# EAGLE design DisplayModulev3 (EAGLE 6.1)
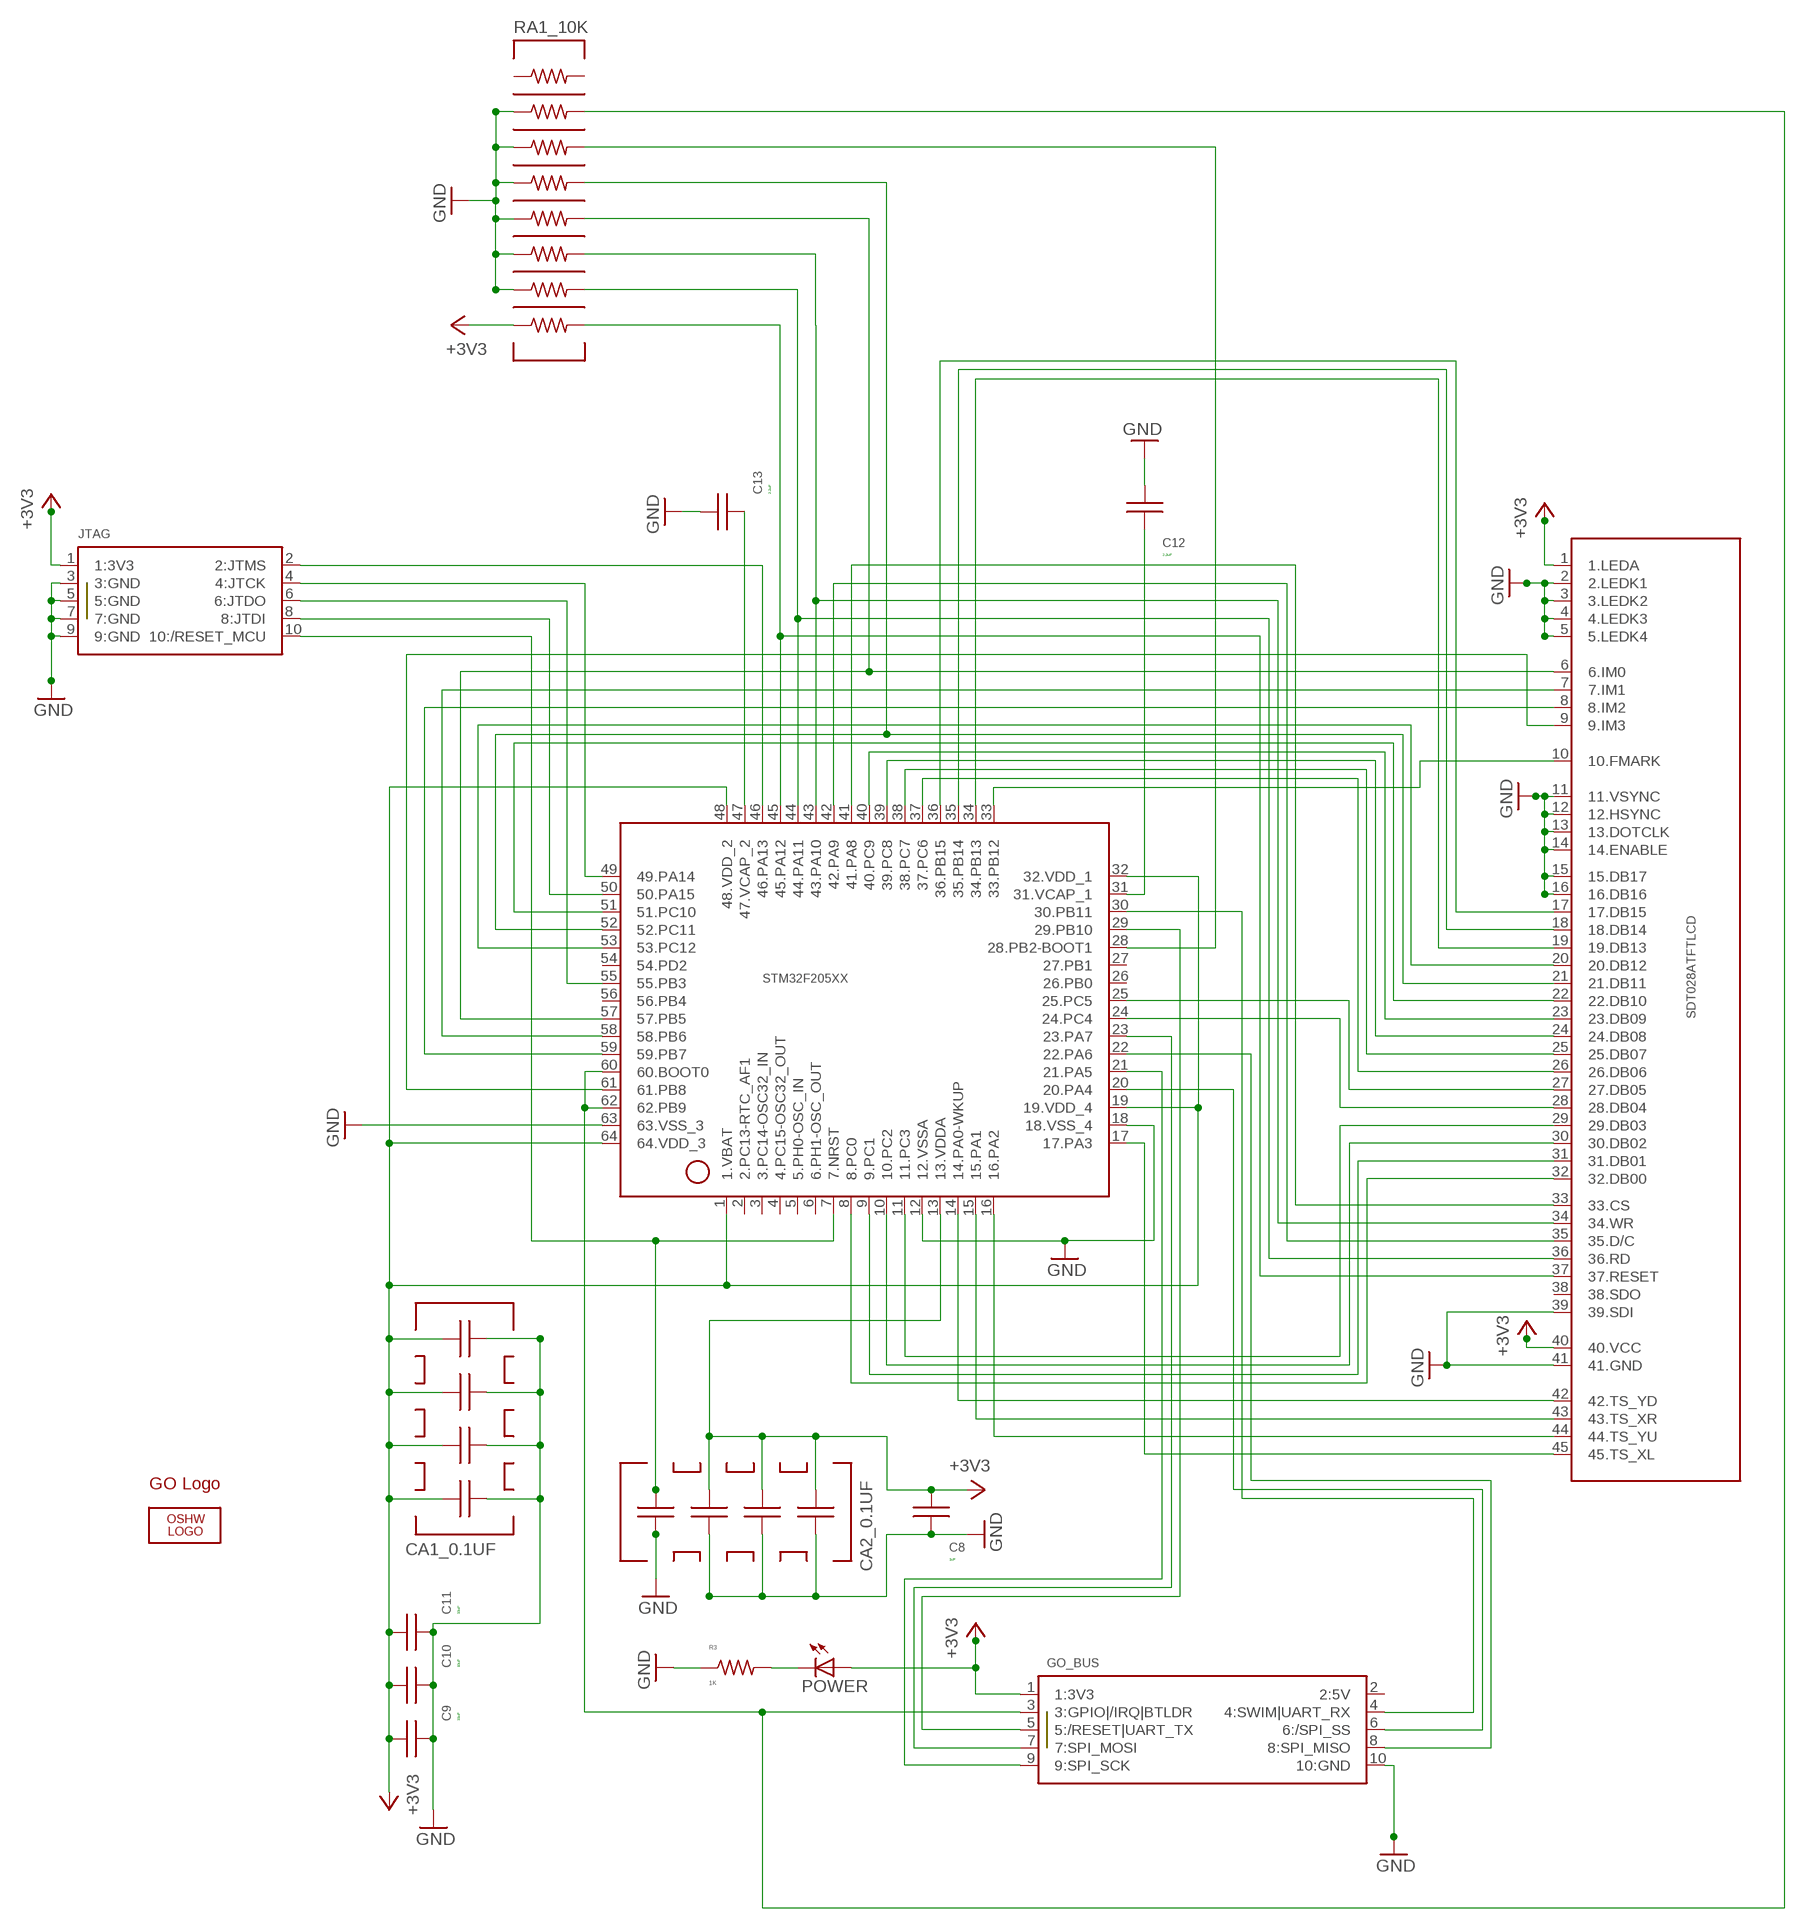
[diagram p0: schematic, sheet 1]

## Parts
C8  1UF  MURATA_GRM_1UF_CER_CAP_0805  [0805]
C9  10UF  MURATA_GRM_10UF_CER_0805  [0805]
C10  10UF  MURATA_GRM_10UF_CER_0805  [0805]
C11  10UF  MURATA_GRM_10UF_CER_0805  [0805]
C12  2.2UF  CAP_CER_2.2UF_0805  [0805]
C13  2.2UF  CAP_CER_2.2UF_0805  [0805]
CA1_0.1UF  TAYIO-YUDEN_0.1UF_CAP_ARRAY_0805  [TAYIO-YUDEN_CAP_ARRAY_4_CIRCUITS_0805]
CA2_0.1UF  TAYIO-YUDEN_0.1UF_CAP_ARRAY_0805  [TAYIO-YUDEN_CAP_ARRAY_4_CIRCUITS_0805]
GO_BUS  GO_CONNECTOR  [FCI-1.27X1.27MM_10PIN_HEADER_SHROUDED_SMT]
JTAG  FCI-MINI_JTAG_HEADER  [FCI-MINI_JTAG_CONNECTOR]
LOGO1  OSHW_LOGO_FILLX0150-NT  [OSHW_FILLX150_NOTEXT]
POWER  LITEON_WHITE_LED_0805  [0805]
R3  1K  RESISTOR_0805  [0805]
RA1_10K  10K  CTS_742C163_RES_ARRAY_8_CIRCUITS_0603  [CTS_742C163_RES_ARRAY_8_CIRCUITS_0603]
SDT028ATFTLCD  HIROSE-FH12  [HIROSE-FH12S-45S-0.5SH]
STM32F205XX  STM32F205XXCORTEXM3RET  [STM32F205XX_LQFP64]
U$1  GO_LOGO  [GO_LOGO]

## Nets
+3V3: C8.K C9.K C10.K C11.K CA1_0.1UF.2 CA1_0.1UF.4 CA1_0.1UF.6 CA1_0.1UF.8 CA2_0.1UF.1 CA2_0.1UF.3 CA2_0.1UF.7 GO_BUS.1(1:3V3) JTAG.1(1:3V3) POWER.A RA1_10K.16 SDT028ATFTLCD.1(1.LEDA) SDT028ATFTLCD.40(40.VCC) STM32F205XX.1(1.VBAT) STM32F205XX.13(13.VDDA) STM32F205XX.19(19.VDD_4) STM32F205XX.32(32.VDD_1) STM32F205XX.48(48.VDD_2) STM32F205XX.64(64.VDD_3)
GND: C8.A C9.A C10.A C11.A C12.K C13.K CA1_0.1UF.1 CA1_0.1UF.3 CA1_0.1UF.5 CA1_0.1UF.7 CA2_0.1UF.2 CA2_0.1UF.4 CA2_0.1UF.6 CA2_0.1UF.8 GO_BUS.10(10:GND) JTAG.3(3:GND) JTAG.5(5:GND) JTAG.7(7:GND) JTAG.9(9:GND) R3.A RA1_10K.4 RA1_10K.6 RA1_10K.8 RA1_10K.10 RA1_10K.12 RA1_10K.14 SDT028ATFTLCD.2(2.LEDK1) SDT028ATFTLCD.3(3.LEDK2) SDT028ATFTLCD.4(4.LEDK3) SDT028ATFTLCD.5(5.LEDK4) SDT028ATFTLCD.11(11.VSYNC) SDT028ATFTLCD.12(12.HSYNC) SDT028ATFTLCD.13(13.DOTCLK) SDT028ATFTLCD.14(14.ENABLE) SDT028ATFTLCD.15(15.DB17) SDT028ATFTLCD.16(16.DB16) SDT028ATFTLCD.39(39.SDI) SDT028ATFTLCD.41(41.GND) STM32F205XX.12(12.VSSA) STM32F205XX.18(18.VSS_4) STM32F205XX.63(63.VSS_3)
N$1: JTAG.2(2:JTMS) STM32F205XX.46(46.PA13)
N$2: JTAG.4(4:JTCK) STM32F205XX.49(49.PA14)
N$3: JTAG.6(6:JTDO) STM32F205XX.55(55.PB3)
N$4: JTAG.8(8:JTDI) STM32F205XX.50(50.PA15)
N$5: CA2_0.1UF.5 JTAG.10(10:/RESET_MCU) STM32F205XX.7(7.NRST)
N$6: SDT028ATFTLCD.32(32.DB00) STM32F205XX.8(8.PC0)
N$7: SDT028ATFTLCD.31(31.DB01) STM32F205XX.9(9.PC1)
N$8: SDT028ATFTLCD.30(30.DB02) STM32F205XX.10(10.PC2)
N$9: SDT028ATFTLCD.29(29.DB03) STM32F205XX.11(11.PC3)
N$10: SDT028ATFTLCD.28(28.DB04) STM32F205XX.24(24.PC4)
N$11: SDT028ATFTLCD.27(27.DB05) STM32F205XX.25(25.PC5)
N$12: SDT028ATFTLCD.26(26.DB06) STM32F205XX.37(37.PC6)
N$13: SDT028ATFTLCD.25(25.DB07) STM32F205XX.38(38.PC7)
N$14: SDT028ATFTLCD.24(24.DB08) STM32F205XX.39(39.PC8)
N$15: SDT028ATFTLCD.23(23.DB09) STM32F205XX.40(40.PC9)
N$16: SDT028ATFTLCD.22(22.DB10) STM32F205XX.51(51.PC10)
N$17: RA1_10K.7 SDT028ATFTLCD.21(21.DB11) STM32F205XX.52(52.PC11)
N$18: SDT028ATFTLCD.20(20.DB12) STM32F205XX.53(53.PC12)
N$19: SDT028ATFTLCD.19(19.DB13) STM32F205XX.34(34.PB13)
N$20: SDT028ATFTLCD.18(18.DB14) STM32F205XX.35(35.PB14)
N$21: SDT028ATFTLCD.17(17.DB15) STM32F205XX.36(36.PB15)
N$22: SDT028ATFTLCD.42(42.TS_YD) STM32F205XX.14(14.PA0-WKUP)
N$23: SDT028ATFTLCD.43(43.TS_XR) STM32F205XX.15(15.PA1)
N$24: SDT028ATFTLCD.44(44.TS_YU) STM32F205XX.16(16.PA2)
N$25: SDT028ATFTLCD.45(45.TS_XL) STM32F205XX.17(17.PA3)
N$26: SDT028ATFTLCD.8(8.IM2) STM32F205XX.59(59.PB7)
N$27: RA1_10K.9 SDT028ATFTLCD.6(6.IM0) STM32F205XX.57(57.PB5)
N$28: SDT028ATFTLCD.7(7.IM1) STM32F205XX.58(58.PB6)
N$29: SDT028ATFTLCD.9(9.IM3) STM32F205XX.61(61.PB8)
N$30: SDT028ATFTLCD.33(33.CS) STM32F205XX.41(41.PA8)
N$31: SDT028ATFTLCD.35(35.D/C) STM32F205XX.42(42.PA9)
N$32: RA1_10K.11 SDT028ATFTLCD.34(34.WR) STM32F205XX.43(43.PA10)
N$33: RA1_10K.13 SDT028ATFTLCD.36(36.RD) STM32F205XX.44(44.PA11)
N$34: RA1_10K.15 SDT028ATFTLCD.37(37.RESET) STM32F205XX.45(45.PA12)
N$35: SDT028ATFTLCD.10(10.FMARK) STM32F205XX.33(33.PB12)
N$36: GO_BUS.6(6:/SPI_SS) STM32F205XX.20(20.PA4)
N$37: GO_BUS.9(9:SPI_SCK) STM32F205XX.21(21.PA5)
N$38: GO_BUS.8(8:SPI_MISO) STM32F205XX.22(22.PA6)
N$39: GO_BUS.7(7:SPI_MOSI) STM32F205XX.23(23.PA7)
N$40: GO_BUS.5(5:/RESET|UART_TX) STM32F205XX.29(29.PB10)
N$41: GO_BUS.4(4:SWIM|UART_RX) STM32F205XX.30(30.PB11)
N$42: GO_BUS.3(3:GPIO|/IRQ|BTLDR) RA1_10K.3 STM32F205XX.60(60.BOOT0) STM32F205XX.62(62.PB9)
N$43: C12.A STM32F205XX.31(31.VCAP_1)
N$44: C13.A STM32F205XX.47(47.VCAP_2)
N$45: RA1_10K.5 STM32F205XX.28(28.PB2-BOOT1)
N$46: POWER.K(C) R3.K
Unconnected: RA1_10K.1 RA1_10K.2 SDT028ATFTLCD.38(38.SDO) STM32F205XX.2(2.PC13-RTC_AF1) STM32F205XX.3(3.PC14-OSC32_IN) STM32F205XX.4(4.PC15-OSC32_OUT) STM32F205XX.5(5.PH0-OSC_IN) STM32F205XX.6(6.PH1-OSC_OUT) STM32F205XX.26(26.PB0) STM32F205XX.27(27.PB1) STM32F205XX.54(54.PD2) STM32F205XX.56(56.PB4)

## Notes on the sheet
- 2.2uF
- 2.2uF
- 1uF
- 10uF
- 10uF
- 10uF

## Power pins joined to a net without a drawn wire
2:5V: GO_BUS.2(2:5V)

## Library data of the parts
C8 = Nwazet.Go:MURATA_GRM_1UF_CER_CAP_0805
C9-C11 = Nwazet.Go:MURATA_GRM_10UF_CER_0805
C12 C13 = Nwazet.Go:CAP_CER_2.2UF_0805
CA1_0.1UF CA2_0.1UF = Nwazet.Go:TAYIO-YUDEN_0.1UF_CAP_ARRAY_0805
GO_BUS = Nwazet.Go:GO_CONNECTOR
JTAG = Nwazet.Go:FCI-MINI_JTAG_HEADER
LOGO1 = ohw-logo:OSHW_LOGO_FILL
POWER = Nwazet.Go:LITEON_WHITE_LED_0805
R3 = Nwazet.Go:RESISTOR_0805
RA1_10K = Nwazet.Go:CTS_742C163_RES_ARRAY_8_CIRCUITS_0603
SDT028ATFTLCD = Nwazet.Go:HIROSE-FH12
STM32F205XX = Nwazet.Go:STM32F205XX
U$1 = Nwazet.Go:GO_LOGO

## Board
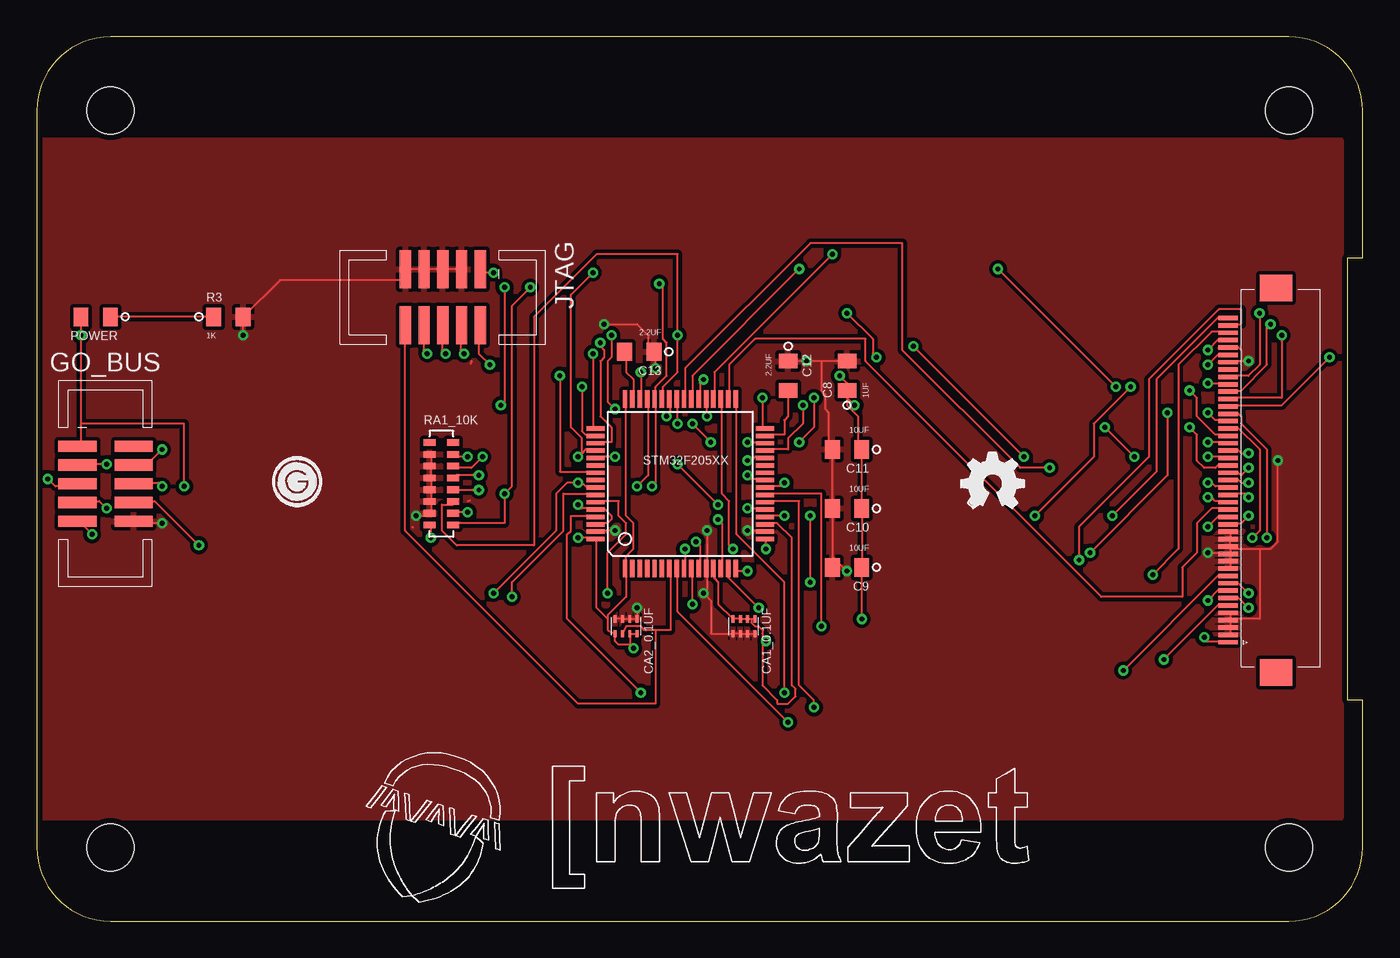
[diagram p1: board, top side]
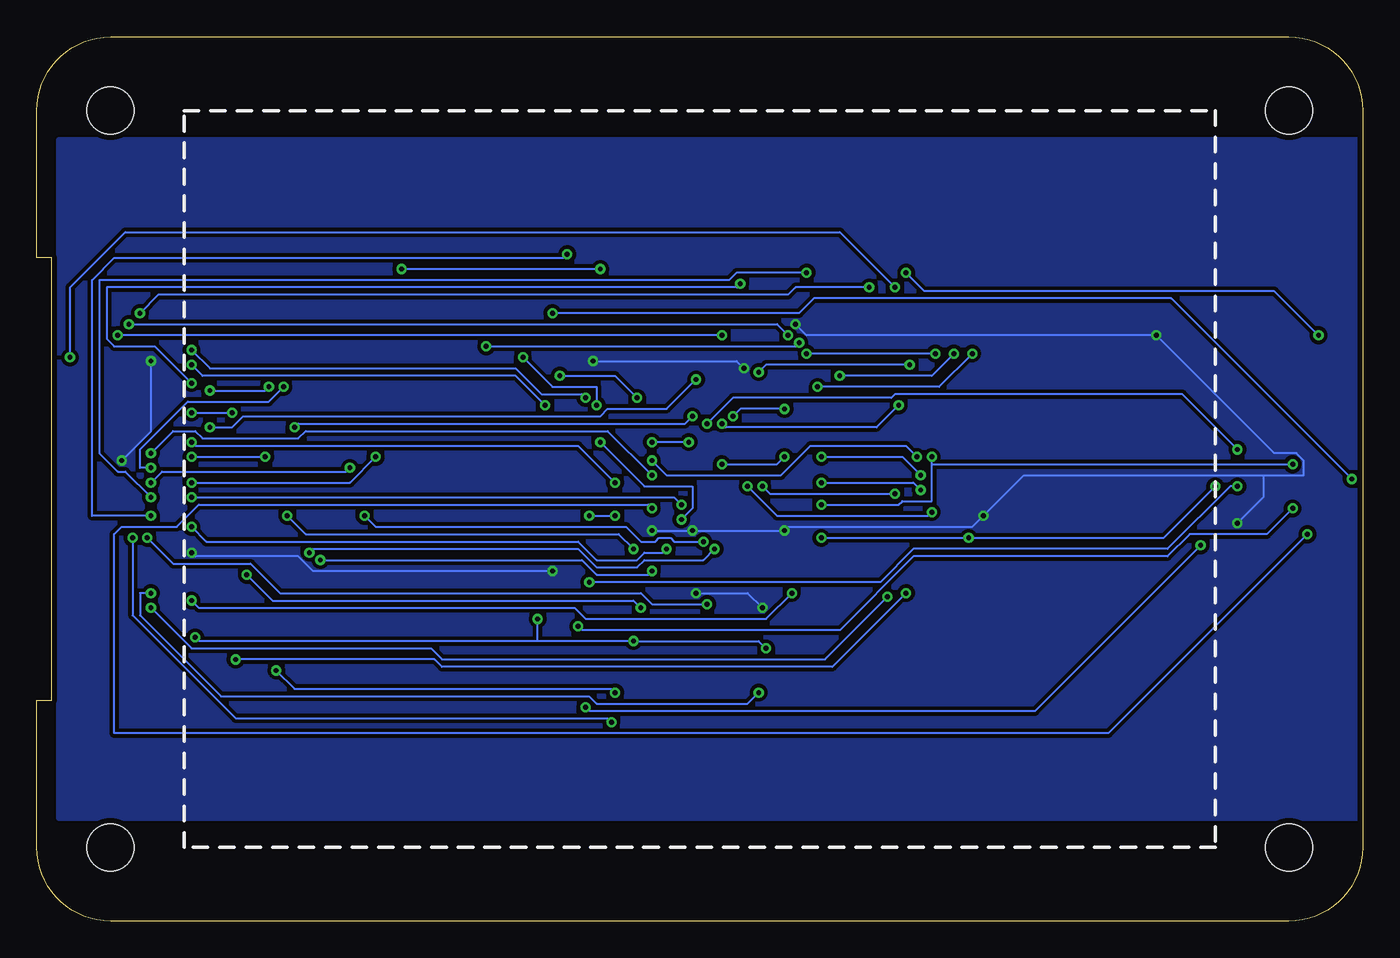
[diagram p2: board, bottom side, seen from below]

Size 90 x 60 mm. Coordinates in mm from the lower left corner, seen from the top.
Outline: 5,0 85,0 arc90 90,5 90,15 89,15 89,45 90,45 90,55 arc90 85,60 5,60 arc90 0,55 0,5 arc90 5,0
Copper layers (1*16): Top 0.0356mm / dielectric 1.5011mm / Bottom 0.0356mm
Design rules: minimum track width 6mil, minimum drill 13mil, track to track 6mil, track to pad 6mil, pad to pad 6mil, via to via 6mil, smd to smd 6mil, copper to edge 15mil, drill to drill 6mil, minimum pad ring 7mil, minimum via ring 7mil, stop-mask expansion 4mil, vias tented up to drill 0mil, thermal gap 10mil
Holes 3.2 mm at 5,5 5,55 85,55 85,5

### Footprints (pad centres in the part's own frame; a part is rotated, then mirrored left to right if it is on the bottom)
0805 = smd 1.25 x 1: A 0,1; K 0,-1
TAYIO-YUDEN_CAP_ARRAY_4_CIRCUITS_0805 = smd 0.2 x 0.5: 1 -0.75,0.5; 2 -0.75,-0.5; 3 -0.25,0.5; 4 -0.25,-0.5; 5 0.25,0.5; 6 0.25,-0.5; 7 0.75,0.5; 8 0.75,-0.5
FCI-1.27X1.27MM_10PIN_HEADER_SHROUDED_SMT = smd 0.76 x 2.6: 1 -2.54,-1.905; 2 -2.54,1.905; 3 -1.27,-1.905; 4 -1.27,1.905; 5 0,-1.905; 6 0,1.905; 7 1.27,-1.905; 8 1.27,1.905; 9 2.54,-1.905; 10 2.54,1.905
FCI-MINI_JTAG_CONNECTOR = smd 0.76 x 2.6: 1 -2.54,-1.905; 2 -2.54,1.905; 3 -1.27,-1.905; 4 -1.27,1.905; 5 0,-1.905; 6 0,1.905; 7 1.27,-1.905; 8 1.27,1.905; 9 2.54,-1.905; 10 2.54,1.905
CTS_742C163_RES_ARRAY_8_CIRCUITS_0603 = smd 0.45 x 0.8: 1 -2.8,0.8; 2 -2.8,-0.8; 3 -2,0.8; 4 -2,-0.8; 5 -1.2,0.8; 6 -1.2,-0.8; 7 -0.4,0.8; 8 -0.4,-0.8; 9 0.4,0.8; 10 0.4,-0.8; 11 1.2,0.8; 12 1.2,-0.8; 13 2,0.8; 14 2,-0.8; 15 2.8,0.8; 16 2.8,-0.8
HIROSE-FH12S-45S-0.5SH = smd 0.3 x 1.3: 1 10.75,-0.65; 2 10.25,-0.65; 3 9.75,-0.65; 4 9.25,-0.65; 5 8.75,-0.65; 6 8.25,-0.65; 7 7.75,-0.65; 8 7.25,-0.65; 9 6.75,-0.65; 10 6.25,-0.65; 11 5.75,-0.65; 12 5.25,-0.65; 13 4.75,-0.65; 14 4.25,-0.65; 15 3.75,-0.65; 16 3.25,-0.65; 17 2.75,-0.65; 18 2.25,-0.65; 19 1.75,-0.65; 20 1.25,-0.65; 21 0.75,-0.65; 22 0.25,-0.65; 23 -0.25,-0.65; 24 -0.75,-0.65; 25 -1.25,-0.65; 26 -1.75,-0.65; 27 -2.25,-0.65; 28 -2.75,-0.65; 29 -3.25,-0.65; 30 -3.75,-0.65; 31 -4.25,-0.65; 32 -4.75,-0.65; 33 -5.25,-0.65; 34 -5.75,-0.65; 35 -6.25,-0.65; 36 -6.75,-0.65; 37 -7.25,-0.65; 38 -7.75,-0.65; 39 -8.25,-0.65; 40 -8.75,-0.65; 41 -9.25,-0.65; 42 -9.75,-0.65; 43 -10.25,-0.65; 44 -10.75,-0.65; 45 -11.25,-0.65 | smd 1.8 x 2.2: P$46 -13.3,2.6; P$47 12.8,2.6
STM32F205XX_LQFP64 = smd 0.3 x 1.2: 1 -3.75,-5.75; 2 -3.25,-5.75; 3 -2.75,-5.75; 4 -2.25,-5.75; 5 -1.75,-5.75; 6 -1.25,-5.75; 7 -0.75,-5.75; 8 -0.25,-5.75; 9 0.25,-5.75; 10 0.75,-5.75; 11 1.25,-5.75; 12 1.75,-5.75; 13 2.25,-5.75; 14 2.75,-5.75; 15 3.25,-5.75; 16 3.75,-5.75; 33 3.75,5.75; 34 3.25,5.75; 35 2.75,5.75; 36 2.25,5.75; 37 1.75,5.75; 38 1.25,5.75; 39 0.75,5.75; 40 0.25,5.75; 41 -0.25,5.75; 42 -0.75,5.75; 43 -1.25,5.75; 44 -1.75,5.75; 45 -2.25,5.75; 46 -2.75,5.75; 47 -3.25,5.75; 48 -3.75,5.75 | smd 1.2 x 0.3: 17 5.75,-3.75; 18 5.75,-3.25; 19 5.75,-2.75; 20 5.75,-2.25; 21 5.75,-1.75; 22 5.75,-1.25; 23 5.75,-0.75; 24 5.75,-0.25; 25 5.75,0.25; 26 5.75,0.75; 27 5.75,1.25; 28 5.75,1.75; 29 5.75,2.25; 30 5.75,2.75; 31 5.75,3.25; 32 5.75,3.75; 49 -5.75,3.75; 50 -5.75,3.25; 51 -5.75,2.75; 52 -5.75,2.25; 53 -5.75,1.75; 54 -5.75,1.25; 55 -5.75,0.75; 56 -5.75,0.25; 57 -5.75,-0.25; 58 -5.75,-0.75; 59 -5.75,-1.25; 60 -5.75,-1.75; 61 -5.75,-2.25; 62 -5.75,-2.75; 63 -5.75,-3.25; 64 -5.75,-3.75

### Placement (x,y rotation side)
C8  55,37 0 top
C9  55,24 90 top
C10  55,28 90 top
C11  55,32 90 top
C12  51,37 180 top
C13  40.9,38.63 90 top
CA1_0.1UF  48,20 180 top
CA2_0.1UF  40,20 180 top
GO_BUS  4.67,29.67 270 top
JTAG  27.56,42.33 180 top
LOGO1  62.75,28 0 top
POWER  4,41 90 top
R3  13,41 270 top
RA1_10K  27.46,29.67 270 top
SDT028ATFTLCD  81.51,29.67 270 top
STM32F205XX  43.68,29.67 0 top
U$1  17.75,29.67 0 top

### Tracks (layer width: path | path; a pad name or v marks a point on that pad's centre or on a via)
+3V3  (via drill 0.33)
  Top 0.152: v49.25,35.5 49.25,33.5 STM32F205XX.32 | v54.5,37 55,36.5 C8.K 55,35.5 | v79.5,37.75 80.25,38.5 80.75,38.5 SDT028ATFTLCD.40 | 55,35.5 v55.5,35 | 55,35.5 55,35 55.75,34.25 55.75,32.25 C11.K C10.K C9.K v56,20.5 | 3,33.75 3,32.25 GO_BUS.1 | 3,33.75 v3,39.75 POWER.A | v31,44 30.25,44 JTAG.1 | v26.75,26 26.75,26.75 RA1_10K.16 | v36.75,26 37.75,26 STM32F205XX.64 38,26 38,21.25 38.75,20.5 | 40.25,18.75 39.5,18.75 39.25,19 CA2_0.1UF.7 38.75,19.75 38.75,20.5 | 40.25,18.75 CA2_0.1UF.3 CA2_0.1UF.1 | 38.75,20.5 38.75,20.75 40,22 40,23.75 STM32F205XX.1 40,24 40,24.75 40.5,25.25 40.5,27 40,27.5 40,35.25 STM32F205XX.48 | 48.5,20.5 CA1_0.1UF.4 CA1_0.1UF.6 CA1_0.1UF.8 46.25,21.5 46.25,23 46,23.25 46,23.75 STM32F205XX.13 | 48.5,20.5 CA1_0.1UF.2 | 49.25,19 49.25,19.5 49.25,19.75 49,20 48.75,20 48.5,20.25 48.5,20.5 | 49.25,19 49.25,16 50.25,15 50.25,14.75 51,14.75 51.5,15.25 51.5,15.75 51.25,16 51.25,26 50.25,27 49.5,27 STM32F205XX.19 | v79.25,19.25 79.25,19 80.75,19 SDT028ATFTLCD.1 | 49.25,19 v49.5,19 | v40.5,18.5 40.25,18.75 | 3,33.75 10,33.75 v10,29.5
  Bottom 0.152: v49.25,35.5 50.75,37 v54.5,37 | v79.5,37.75 78.75,37 57.5,37 v55.5,35 | v31,44 29.75,42.75 6,42.75 v3,39.75 | v36.75,26 v26.75,26 13.5,26 v10,29.5 | v79.25,19.25 79,19 56,19 | 56,19 v49.5,19 41,19 v40.5,18.5 | 56,19 v56,20.5
GND  (via drill 0.33)
  Top 0.152: 81,20 81,19.5 SDT028ATFTLCD.2 | 81,20 SDT028ATFTLCD.3 81,20 | 81,20.5 81,21 SDT028ATFTLCD.5 | 81,20.5 SDT028ATFTLCD.4 | 81,20.5 81,20 | 81,20.5 SDT028ATFTLCD.4 | 81.75,38 81,38 SDT028ATFTLCD.39 | 81.75,38 81.75,38.75 81.5,39 81,39 SDT028ATFTLCD.41 | 81,26 81,26.5 SDT028ATFTLCD.16 | 81,26 SDT028ATFTLCD.15 81,26 | 81,24.5 81,24 SDT028ATFTLCD.11 | 81,24.5 SDT028ATFTLCD.12 81,24.5 | 81,25.5 81,25.25 | 81,25.25 81,25 | 81,25 SDT028ATFTLCD.13 | 81,25.5 SDT028ATFTLCD.14 81,25.5 | 81,25 81,24.5 | 81,25 SDT028ATFTLCD.13 | 81,25.5 81,26 | v82.25,38 81.75,38 | v84.25,31.25 84.25,25.75 83.75,25.25 83,25.25 | 81,25.25 83,25.25 | 81,20.5 83,20.5 83,25.25 | 81,20.5 SDT028ATFTLCD.4 | 54,24.75 C10.A C11.A 53.75,32.25 53.75,34.5 53.5,34.75 53.5,35.75 53.25,36 53.25,38 | 54,24.75 C9.A | C8.A 53.25,38 | 53.25,38 v52.25,38 C12.K | v42,37.5 42,38.5 C13.K 41.75,38.75 41.5,39 41.5,39.75 40.75,40.5 v38.5,40.5 | v79.5,25 80.75,25 SDT028ATFTLCD.13 | 54,24.75 v55,23.75 | JTAG.3 28.75,44.25 27.75,44.25 JTAG.5 27.5,44.25 26.5,44.25 JTAG.7 26.25,44.25 25.25,44.25 JTAG.9 25,44 25,43.5 16.5,43.5 R3.A v14,39.75 | CA1_0.1UF.1 CA1_0.1UF.3 CA1_0.1UF.5 CA1_0.1UF.7 45.75,19.5 45.75,21.75 v45.25,22.25 45.5,22.5 45.5,23.75 STM32F205XX.12 45.5,24 v45.5,26.5 | CA2_0.1UF.8 CA2_0.1UF.6 CA2_0.1UF.4 CA2_0.1UF.2 v40.75,21.25 | RA1_10K.4 26.75,31.5 26.75,31 RA1_10K.6 26.75,30.75 26.75,30.25 RA1_10K.8 26.75,30 26.75,29.25 | 26.75,29.25 RA1_10K.10 26.75,29.25 | 26.75,29.25 26.75,28.5 RA1_10K.12 26.75,28.25 26.75,27.75 RA1_10K.14 26.5,27.5 v25.75,27.5 | v39.25,26.5 38,26.5 STM32F205XX.63 | v48.25,26.5 49.25,26.5 STM32F205XX.18 | v8.5,27 6.75,27 GO_BUS.10
  Top 0.152: 29.25,28.5 29.41,28.55 | 29.25,28.5 29.41,28.55 | 29.25,28.5 29.41,28.55 | 29.25,28.5 29.41,28.55 | 29.25,28.5 29.41,28.55 | 29.25,28.5 29.41,28.55 | 26.25,27.75 26.25,27.67 | 26.25,27.75 26.25,27.67 | 26.25,27.75 26.25,27.67 | 26.25,27.75 26.25,27.67 | 26.25,27.75 26.25,27.67 | 26.25,27.75 26.25,27.67 | 29.5,38 29.45,37.82 | 29.5,38 29.45,37.82 | 29.5,38 29.45,37.82 | 29.5,38 29.45,37.82 | 29.5,38 29.45,37.82 | 29.5,38 29.45,37.82 | 29.5,38 29.45,37.82 | 29.5,38 29.45,37.82 | 25.5,26.75 25.53,26.72 | 25.5,26.75 25.53,26.72 | 25.5,26.75 25.53,26.72 | 25.5,26.75 25.53,26.72 | 25.5,26.75 25.53,26.72 | 25.5,26.75 25.53,26.72 | 29.25,28.5 29.41,28.55 | 29.25,28.5 29.41,28.55 | 29.25,28.5 29.41,28.55 | 29.25,28.5 29.41,28.55 | 29.25,28.5 29.41,28.55 | 29.25,28.5 29.41,28.55 | 26.25,27.75 26.25,27.67 | 26.25,27.75 26.25,27.67 | 26.25,27.75 26.25,27.67 | 26.25,27.75 26.25,27.67 | 26.25,27.75 26.25,27.67 | 26.25,27.75 26.25,27.67 | 29.5,38 29.45,37.82 | 29.5,38 29.45,37.82 | 29.5,38 29.45,37.82 | 29.5,38 29.45,37.82 | 29.5,38 29.45,37.82 | 29.5,38 29.45,37.82 | 29.5,38 29.45,37.82 | 29.5,38 29.45,37.82 | 25.5,26.75 25.53,26.72 | 25.5,26.75 25.53,26.72 | 25.5,26.75 25.53,26.72 | 25.5,26.75 25.53,26.72 | 25.5,26.75 25.53,26.72
  Bottom 0.152: v82.25,38 82.25,33.25 v84.25,31.25 | v42,37.5 42.5,38 v52.25,38 | v79.5,25 79.25,24.75 72.25,24.75 71.25,23.75 v55,23.75 | v40.75,21.25 41.75,22.25 v45.25,22.25 | v48.25,26.5 v45.5,26.5 v39.25,26.5 39,26.75 26.5,26.75 v25.75,27.5 23,30.25 6.75,30.25 | v8.5,27 6.75,28.75 6.75,30.25 | 6.75,30.25 4,30.25 4,31.25 4.5,31.75 6,31.75 v14,39.75 37.75,39.75 v38.5,40.5
  pour Bottom (isolate 0.254): 0.25,53 88.5,53 88.5,7 0.25,7
  pour Top (isolate 0.254): 0.25,53 88.5,53 88.5,7 0.25,7
N$1  (via drill 0.33)
  Top 0.152: v41,37.25 41,35.5 STM32F205XX.46 | v30.75,37.75 30,38.5 30,40.25 JTAG.2
  Bottom 0.152: v41,37.25 40.5,37.75 v30.75,37.75
N$2  (via drill 0.33)
  Top 0.152: v37.75,38.5 37.75,33.5 STM32F205XX.49 | v29,38.5 28.75,38.75 28.75,40.25 JTAG.4
  Bottom 0.152: v29,38.5 v37.75,38.5
N$3  (via drill 0.33)
  Top 0.152: v35.5,37 35.5,30.5 37.75,30.5 STM32F205XX.55 | v27.75,38.5 27.5,38.75 27.5,40.25 JTAG.6
  Bottom 0.152: v35.5,37 29.25,37 v27.75,38.5
N$4  (via drill 0.33)
  Top 0.152: v37,36.25 37,33.25 37.25,33 37.75,33 STM32F205XX.50 | v26.5,38.5 26.25,38.75 26.25,40.25 JTAG.8
  Bottom 0.152: v37,36.25 28.75,36.25 v26.5,38.5
N$5
  Top 0.152: CA2_0.1UF.5 40,20 40.75,20 41,20 41.25,19.75 42,19.75 | 42,19.75 43,19.75 43,23.75 STM32F205XX.7 | 42,19.75 42,14.75 36.75,14.75 25,26.5 25,40.25 JTAG.10
N$6  (via drill 0.33)
  Top 0.152: v51,13.5 43.5,21 43.5,23.75 STM32F205XX.8 | v83.5,26 83.5,32 81.75,33.75 81.75,34.25 81.5,34.5 81,34.5 SDT028ATFTLCD.32
  Bottom 0.152: v51,13.5 51.25,13.75 76.5,13.75 83.5,20.75 v83.5,26
N$7  (via drill 0.33)
  Top 0.152: v44,25.25 44,24 STM32F205XX.9 | v71.5,25 76.75,30.25 v76.75,34.5 | v79.5,34.5 80,34 80.75,34 SDT028ATFTLCD.31
  Bottom 0.152: v44,25.25 44.75,24.5 48.75,24.5 49.25,24 52,24 53.25,25.25 71.25,25.25 v71.5,25 | v79.5,34.5 v76.75,34.5
N$8  (via drill 0.33)
  Top 0.152: v44.5,21.5 44.5,23.75 STM32F205XX.10 | v82.5,26 83,26.5 83,32 81.5,33.5 81,33.5 SDT028ATFTLCD.30
  Bottom 0.152: v44.5,21.5 48.25,21.5 49,22.25 73.5,22.25 75.5,24.25 80.75,24.25 v82.5,26
N$9  (via drill 0.33)
  Top 0.152: v44.75,25.75 45,25.5 45,24 STM32F205XX.11 | v67.75,27.5 71.75,31.5 71.75,33.75 v74.25,36.25 | v78.25,36 78.75,35.5 78.75,34.25 80,33 80.75,33 SDT028ATFTLCD.29
  Bottom 0.152: v44.75,25.75 46.75,25.75 47,26 47.75,26 48,25.75 49,25.75 50,26.75 67,26.75 v67.75,27.5 | v74.25,36.25 74.5,36 v78.25,36
N$10  (via drill 0.33)
  Top 0.152: v50.75,29.75 50.75,29.5 49.5,29.5 STM32F205XX.24 | v79.5,32.5 80.75,32.5 SDT028ATFTLCD.28
  Bottom 0.152: v50.75,29.75 53.25,32.25 79.25,32.25 v79.5,32.5
N$11  (via drill 0.33)
  Top 0.152: v48.25,30.25 48.25,30 49.25,30 STM32F205XX.25 | v82.25,31.75 81.75,31.75 81.5,32 81,32 SDT028ATFTLCD.27
  Bottom 0.152: v48.25,30.25 51.25,33.25 71.75,33.25 72.25,32.75 78.75,32.75 79.25,33.25 80.75,33.25 v82.25,31.75
N$12  (via drill 0.33)
  Top 0.152: v45.5,34.25 45.5,35.25 STM32F205XX.37 | v74.5,31.5 v72.5,33.5 | v79.5,31.5 80.75,31.5 SDT028ATFTLCD.26
  Bottom 0.152: v45.5,34.25 46,33.75 72.25,33.75 v72.5,33.5 | v79.5,31.5 v74.5,31.5
N$13  (via drill 0.33)
  Top 0.152: v45.25,36.75 45,36.5 45,35.5 STM32F205XX.38 | v78.25,33.5 78.75,33 78.75,31.25 79.25,30.75 80,30.75 80.25,31 80.75,31 SDT028ATFTLCD.25
  Bottom 0.152: v45.25,36.75 47.25,34.75 51.25,34.75 51.75,34.25 76,34.25 76.75,33.5 v78.25,33.5
N$14  (via drill 0.33)
  Top 0.152: v51.75,44.25 44.5,37 44.5,35.5 STM32F205XX.39 | v73.25,36.25 v65.25,44.25 | v82.25,30.75 81.75,30.25 81.5,30.5 81,30.5 SDT028ATFTLCD.24
  Bottom 0.152: v65.25,44.25 v51.75,44.25 | v73.25,36.25 74.25,35.25 79.75,35.25 83,32 83,30.75 v82.25,30.75
N$15  (via drill 0.33)
  Top 0.152: v68.75,30.75 66.75,30.75 58.75,38.75 58.75,46 52.5,46 44,37.5 44,35.5 STM32F205XX.40 | v82.25,29.75 81.75,29.75 81.5,30 81,30 SDT028ATFTLCD.23
  Bottom 0.152: v68.75,30.75 69,30.5 81.5,30.5 v82.25,29.75
N$16  (via drill 0.33)
  Top 0.152: v38.25,39.25 38.25,39 38.5,38.75 38.5,38.25 38.25,38 38.25,34.25 39,33.5 39,32.5 38,32.5 STM32F205XX.51 | v67,31.5 v59.5,39 | v79.5,29.75 79.75,29.75 80,29.5 80.75,29.5 SDT028ATFTLCD.22
  Bottom 0.152: v38.25,39.25 38.5,39 v59.5,39 | v67,31.5 68.75,29.75 v79.5,29.75
N$17  (via drill 0.33)
  Top 0.152: v30,30.25 28.5,30.25 RA1_10K.7 | 37,31.75 37.25,32 37.75,32 STM32F205XX.52 | 37,31.75 v36.75,31.5 | v82.25,28.75 82.25,29 81,29 SDT028ATFTLCD.21 | v37.75,44 36.25,42.5 36.25,33.5 37,32.75 37,31.75
  Bottom 0.152: v30,30.25 31.25,31.5 v36.75,31.5 | v82.25,28.75 84,30.5 84.5,30.5 85.75,31.75 85.75,43.5 43,43.5 42.5,44 v37.75,44
N$18  (via drill 0.33)
  Top 0.152: v39.25,31.5 38,31.5 STM32F205XX.53 | v46.25,28.25 v43.5,31 | v79.5,28.75 79.75,28.75 80,28.5 80.75,28.5 SDT028ATFTLCD.20
  Bottom 0.152: v39.25,31.5 39.75,31 v43.5,31 | v46.25,28.25 46.75,28.75 v79.5,28.75
N$19
  Top 0.152: STM32F205XX.34 47,35.5 47,37.75 48.75,39.5 56.25,39.5 56.25,38 72.25,22 77.75,22 77.75,24 78.75,25 78.75,27 79.75,28 80.75,28 SDT028ATFTLCD.19
N$20  (via drill 0.33)
  Top 0.152: v47.25,25.25 47,25.5 47,28.5 46.5,29 46.5,35.25 STM32F205XX.35 | v79.5,26.75 80.25,27.5 80.75,27.5 SDT028ATFTLCD.18
  Bottom 0.152: v47.25,25.25 47.5,25 48.75,25 49.25,24.5 52,24.5 53.25,25.75 78.5,25.75 v79.5,26.75
N$21  (via drill 0.33)
  Top 0.152: v54,45.25 46,37.25 46,35.5 STM32F205XX.36 | v82.25,27.5 81.75,27 81,27 SDT028ATFTLCD.17
  Bottom 0.152: v54,45.25 54.25,45 84.75,45 86.25,43.5 86.25,27.5 v82.25,27.5
N$22  (via drill 0.33)
  Top 0.152: v46.25,27.25 46.5,27 46.5,24 STM32F205XX.14 | v51.75,32.5 52.75,33.5 v52.75,35.5 | v79.5,38.75 80.25,39.5 80.75,39.5 SDT028ATFTLCD.42
  Bottom 0.152: v46.25,27.25 45.5,28 45.5,29.5 48.75,29.5 v51.75,32.5 | v52.75,35.5 53,35.75 55.75,35.75 57.5,37.5 78.25,37.5 v79.5,38.75
N$23  (via drill 0.33)
  Top 0.152: v49,21.25 47,23.25 47,23.75 STM32F205XX.15 | v75.75,23.5 77.5,25.25 77.5,37.75 79.75,40 80.75,40 SDT028ATFTLCD.43
  Bottom 0.152: v49,21.25 49.5,21.75 74,21.75 v75.75,23.5
N$24  (via drill 0.33)
  Top 0.152: v48.25,23.75 47.5,23.75 STM32F205XX.16 | v70.75,24.5 70.75,26.75 75.5,31.5 75.5,36.75 80.25,41.5 81.75,41.5 81.75,40.5 81,40.5 SDT028ATFTLCD.44
  Bottom 0.152: v48.25,23.75 48.5,23.5 52,23.5 53,24.5 v70.75,24.5
N$25  (via drill 0.33)
  Top 0.152: v49.5,25.25 49.5,26 STM32F205XX.17 | v73,27.5 76,30.5 76,36.75 80.25,41 80.75,41 SDT028ATFTLCD.45
  Bottom 0.152: v49.5,25.25 50.5,26.25 71.75,26.25 v73,27.5
N$26  (via drill 0.33)
  Top 0.152: v38.75,22.25 38.75,25 40,26.25 40,27 39.5,27.5 39.5,28.5 38,28.5 STM32F205XX.59 | v79.5,21.75 80.25,22.5 80.75,22.5 SDT028ATFTLCD.8
  Bottom 0.152: v38.75,22.25 40.5,20.5 52.75,20.5 53.5,21.25 79,21.25 v79.5,21.75
N$27  (via drill 0.33)
  Top 0.152: v30,29.25 28.5,29.25 RA1_10K.9 | STM32F205XX.57 37.75,29.5 37.25,29.5 37,29.75 v36.75,29.75 36,29.75 35.25,29 35.25,26.5 v31,22.25 | v76.5,17.75 80.25,21.5 80.75,21.5 SDT028ATFTLCD.6
  Bottom 0.152: v30,29.25 30.5,29.75 v36.75,29.75 | v76.5,17.75 63,17.75 62.5,17.25 36,17.25 v31,22.25
N$28  (via drill 0.33)
  Top 0.152: v32.25,22 32.25,23 35.75,26.5 35.75,29 37.75,29 STM32F205XX.58 | v82.25,21.25 81.5,22 81,22 SDT028ATFTLCD.7
  Bottom 0.152: v32.25,22 36.5,17.75 62.5,17.75 63.25,18.5 79.5,18.5 v82.25,21.25
N$29  (via drill 0.33)
  Top 0.152: v41,15.5 36,20.5 36,26.25 36.25,26.5 36.25,27.5 37.75,27.5 STM32F205XX.61 | v82.25,22.25 81.5,23 81,23 SDT028ATFTLCD.9
  Bottom 0.152: v41,15.5 41.75,14.75 52,14.75 52.5,15.25 77.5,15.25 83,20.75 83,22.25 v82.25,22.25
N$30  (via drill 0.33)
  Top 0.152: v43.5,33.75 43.5,35.25 STM32F205XX.41 | v31.5,35 31.75,35.25 v31.75,43 | v87.75,38.25 84.5,35 81,35 SDT028ATFTLCD.33
  Bottom 0.152: v43.5,33.75 43.25,33.5 33,33.5 v31.5,35 | v31.75,43 35.5,46.75 84,46.75 87.75,43 v87.75,38.25
N$31  (via drill 0.33)
  Top 0.152: v42.75,34.25 43,34.5 43,35.25 STM32F205XX.42 | v39.25,34.75 38.75,35.25 38.75,38 39,38.25 v39,39.75 | v83.75,40.5 83.5,40.25 83.5,37.75 81.75,36 81,36 SDT028ATFTLCD.35
  Bottom 0.152: v42.75,34.25 42.25,34.75 v39.25,34.75 | v39,39.75 39.75,40.5 v83.75,40.5
N$32  (via drill 0.33)
  Top 0.152: RA1_10K.11 28.25,28.25 27.5,28.25 27.5,26.5 28.5,25.5 33.75,25.5 33.75,41 38,45.25 43.5,45.25 v43.5,39.75 43.5,37.25 42.5,36.25 42.5,35.5 STM32F205XX.43 | v84.5,39.75 84.5,35.5 81,35.5 SDT028ATFTLCD.34
  Bottom 0.152: v43.5,39.75 v84.5,39.75
N$33  (via drill 0.33)
  Top 0.152: v29.25,27.75 28.5,27.75 RA1_10K.13 | v41.75,29.5 42,29.75 42,35.25 STM32F205XX.44 42,35.5 42,36.25 42.75,37 42.75,39.25 42.5,39.5 42.5,43 v42.25,43.25 | v79.5,36.5 80.75,36.5 SDT028ATFTLCD.36
  Bottom 0.152: v29.25,27.75 29.5,27.5 39.75,27.5 v41.75,29.5 | v79.5,36.5 82,39 84.75,39 85.25,39.5 85.25,43 42.5,43 v42.25,43.25
N$34  (via drill 0.33)
  Top 0.152: v40.75,29.5 41.5,30.25 41.5,35.25 STM32F205XX.45 | RA1_10K.15 28.5,27 31.75,27 v31.75,29 32.25,29.5 32.25,41.75 v33.5,43 | v83,41.25 83,37.75 82.25,37 81,37 SDT028ATFTLCD.37
  Bottom 0.152: v31.75,29 40.25,29 v40.75,29.5 | v83,41.25 81.75,42.5 39,42.5 38.5,43 v33.5,43
N$35  (via drill 0.33)
  Top 0.152: v50.75,15.5 50.75,23 47.5,26.25 47.5,35.25 STM32F205XX.33 | v73.75,17 80.25,23.5 80.75,23.5 SDT028ATFTLCD.10
  Bottom 0.152: v50.75,15.5 51,15.75 72.5,15.75 v73.75,17
N$36  (via drill 0.33)
  Top 0.152: v50.75,27.5 49.5,27.5 STM32F205XX.20 | v52.5,23 v52.5,27.5 | v8.5,29.5 8.25,29.75 6.75,29.75 GO_BUS.6
  Bottom 0.152: v52.5,27.5 v50.75,27.5 | v52.5,23 32.75,23 30.5,25.25 13.25,25.25 9,29.5 v8.5,29.5
N$37  (via drill 0.33)
  Top 0.152: v48.25,28 49.25,28 STM32F205XX.21 | v3.75,26.25 3,27 GO_BUS.9
  Bottom 0.152: v48.25,28 48.5,28.25 79,28.25 80.5,26.75 84.25,26.75 84.75,26.25 84.75,12.75 17.25,12.75 v3.75,26.25
N$38  (via drill 0.33)
  Top 0.152: v52.75,14.5 52.75,15 51.75,16 51.75,28.5 49.5,28.5 STM32F205XX.22 | v11,25.5 8,28.5 6.75,28.5 GO_BUS.8
  Bottom 0.152: v52.75,14.5 52.5,14.25 22.25,14.25 v11,25.5
N$39  (via drill 0.33)
  Top 0.152: v53.25,20 53.25,29 49.5,29 STM32F205XX.23 | v4.75,28 4.25,28.5 3,28.5 GO_BUS.7
  Bottom 0.152: v53.25,20 53,19.75 35.5,19.75 30.5,24.75 13.25,24.75 11.75,26.25 6.5,26.25 v4.75,28
N$40  (via drill 0.33)
  Top 0.152: v52,35 52,33.75 51,32.75 51,32 49.5,32 STM32F205XX.29 | v57,38.25 56.75,38.5 56.75,39.5 v55,41.25 | v0.75,30 1.25,29.5 2.75,29.5 GO_BUS.5
  Bottom 0.152: v52,35 52,36.25 55,36.25 v57,38.25 | v55,41.25 38.25,41.25 37.25,42.25 13,42.25 v0.75,30
N$41  (via drill 0.33)
  Top 0.152: v48.25,32.5 49.25,32.5 STM32F205XX.30 | v44.5,33.75 v45.75,32.5 | v8.5,32 7.5,31 6.75,31 GO_BUS.4
  Bottom 0.152: v45.75,32.5 v48.25,32.5 | v44.5,33.75 42.75,35.5 32,35.5 31.75,35.75 12.25,35.75 v8.5,32
N$42  (via drill 0.33)
  Top 0.152: v29.25,31.5 28.5,31.5 RA1_10K.3 | v36.75,28.25 37,28 37.75,28 STM32F205XX.60 38,28 38.5,28 39,27.5 39,27.25 38.75,27 38,27 STM32F205XX.62 | v4.75,31 3,31 GO_BUS.3
  Bottom 0.152: 29.25,31 29.25,28.5 31.25,28.5 31.5,28.25 v36.75,28.25 | 29.25,31 v29.25,31.5 | 29.25,31 v4.75,31
N$43
  Top 0.152: C12.A 51,34.25 50.75,34 50.75,33 49.5,33 STM32F205XX.31
N$44
  Top 0.152: STM32F205XX.47 40.5,35.5 40.5,36.75 40,37.25 40,38.5 C13.A
N$45  (via drill 0.33)
  Top 0.152: v30.25,31.5 29.5,30.75 28.5,30.75 RA1_10K.5 | v48.25,31.25 48.5,31.25 48.75,31.5 49.25,31.5 STM32F205XX.28
  Bottom 0.152: v30.25,31.5 31,32.25 37.5,32.25 39.5,30.25 47.25,30.25 v48.25,31.25
N$46
  Top 0.152: R3.K POWER.K